# EAGLE design LPEM (EAGLE 9.3.1)

## Sheet 1 of 2
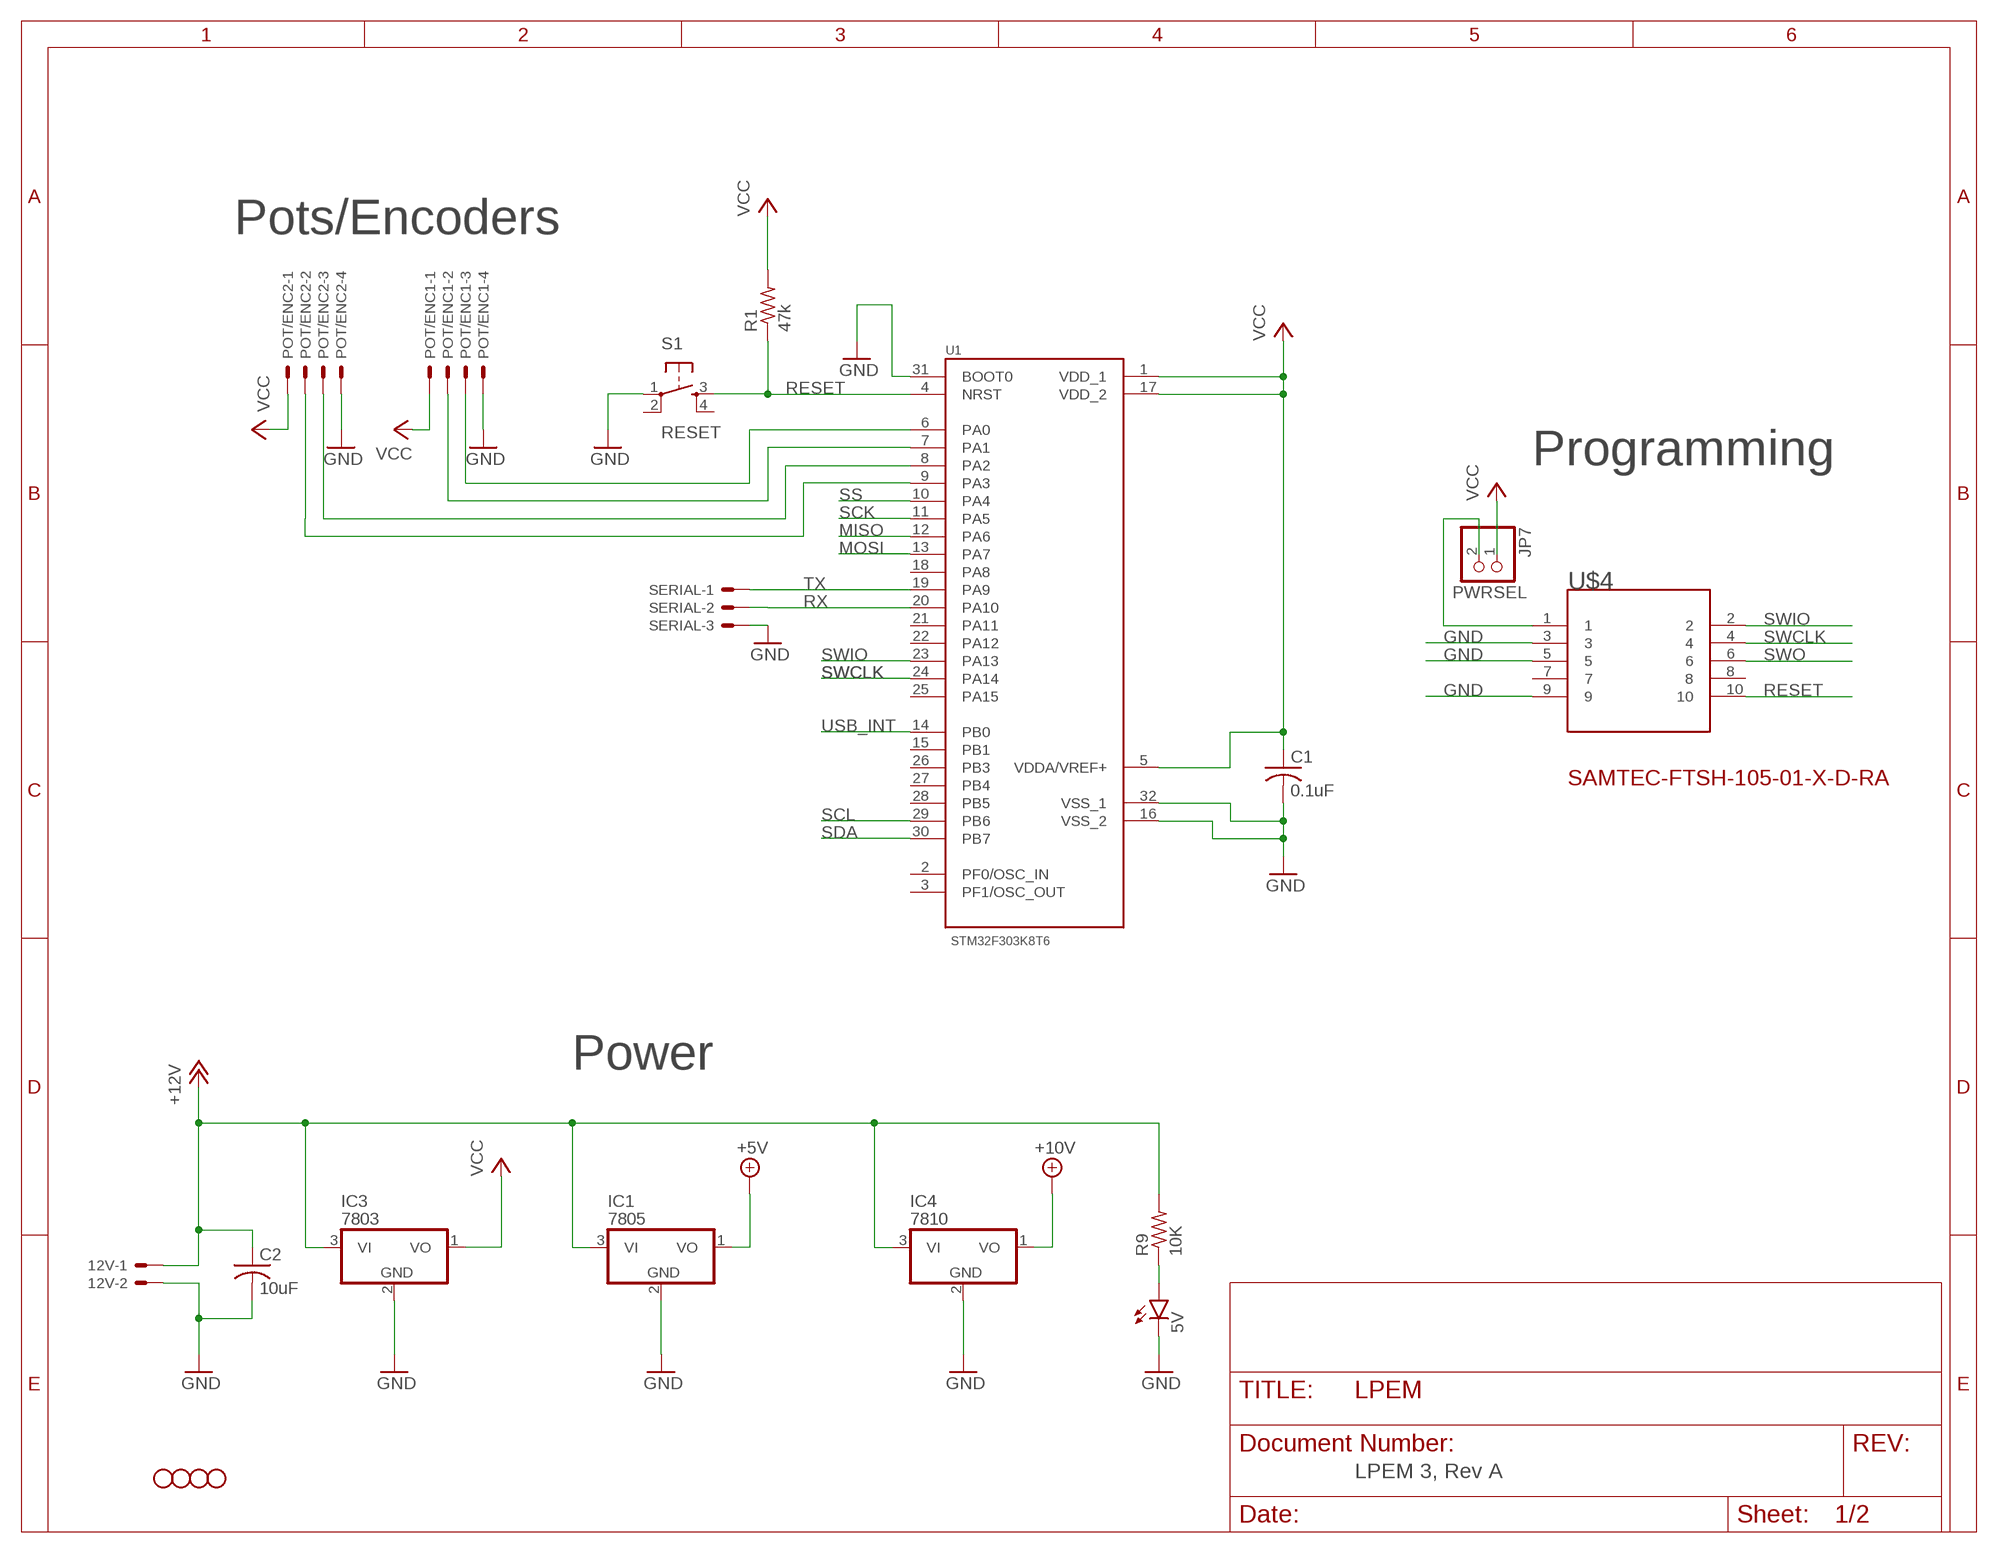
[diagram p0: schematic, sheet 1]

### Parts
5V  LED3MM  [LED3MM]
12V  22-23-2021  [22-23-2021]
C1  0.1uF  C-US025-025X050  [C025-025X050]
C2  10uF  C-US025-025X050  [C025-025X050]
IC1  7805  78L05Z  [TO92]
IC3  7803  78L05Z  [TO92]
IC4  7810  78L05Z  [TO92]
JP1  STAND-OFF  [STAND-OFF]
JP2  STAND-OFF  [STAND-OFF]
JP7  PWRSEL  PINHD-1X2  [1X02]
JP8  STAND-OFF  [STAND-OFF]
JP9  STAND-OFF  [STAND-OFF]
POT/ENC1  22-23-2041  [22-23-2041]
POT/ENC2  22-23-2041  [22-23-2041]
R1  47k  R-US_0204/5  [0204/5]
R9  10K  R-US_0204/5  [0204/5]
S1  RESET  TAC_SWITCHPTH  [TACTILE-PTH]
SERIAL  22-23-2031  [22-23-2031]
U1  STM32F303K8T6  [QFP80P900X900X160-32N]
U$4  SAMTEC-FTSH-105-01-X-D-RAJ  [SAMTEC-FTSH-105-01-X-D-RA]

### Nets
+5V [power]: IC1.1(VO) ; also sheet 2
+10V [power]: IC4.1(VO) ; also sheet 2
+12V [power]: 12V.1 C2.1 IC1.3(VI) IC3.3(VI) IC4.3(VI) R9.2 ; also sheet 2
GND [power]: 5V.K(C) 12V.2 C1.2 C2.2 IC1.2(GND) IC3.2(GND) IC4.2(GND) POT/ENC1.4 POT/ENC2.4 S1.1 SERIAL.3 U1.16(VSS_2) U1.31(BOOT0) U1.32(VSS_1) U$4.3 U$4.5 U$4.9 ; also sheet 2
MISO: U1.12(PA6) ; also sheet 2
MOSI: U1.13(PA7) ; also sheet 2
N$1: POT/ENC2.3 U1.8(PA2)
N$2: POT/ENC2.2 U1.9(PA3)
N$3: POT/ENC1.3 U1.6(PA0)
N$4: JP7.2 U$4.1
N$5: 5V.A R9.1
N$6: POT/ENC1.2 U1.7(PA1)
RESET: R1.1 S1.3 U1.4(NRST) U$4.10
RX: SERIAL.2 U1.20(PA10)
SCK: U1.11(PA5) ; also sheet 2
SCL: U1.29(PB6) ; also sheet 2
SDA: U1.30(PB7) ; also sheet 2
SS: U1.10(PA4) ; also sheet 2
SWCLK: U1.24(PA14) U$4.4
SWIO: U1.23(PA13) U$4.2
SWO: U$4.6
TX: SERIAL.1 U1.19(PA9)
USB_INT: U1.14(PB0) ; also sheet 2
VCC [power]: C1.1 IC3.1(VO) JP7.1 POT/ENC1.1 POT/ENC2.1 R1.2 U1.1(VDD_1) U1.5(VDDA/VREF+) U1.17(VDD_2) ; also sheet 2
Unconnected: S1.2 S1.4 U1.2(PF0/OSC_IN) U1.3(PF1/OSC_OUT) U1.15(PB1) U1.18(PA8) U1.21(PA11) U1.22(PA12) U1.25(PA15) U1.26(PB3) U1.27(PB4) U1.28(PB5) U$4.7 U$4.8

### Notes on the sheet
- Pots/Encoders
- Programming
- Power
- LPEM 3, Rev A

## Sheet 2 of 2
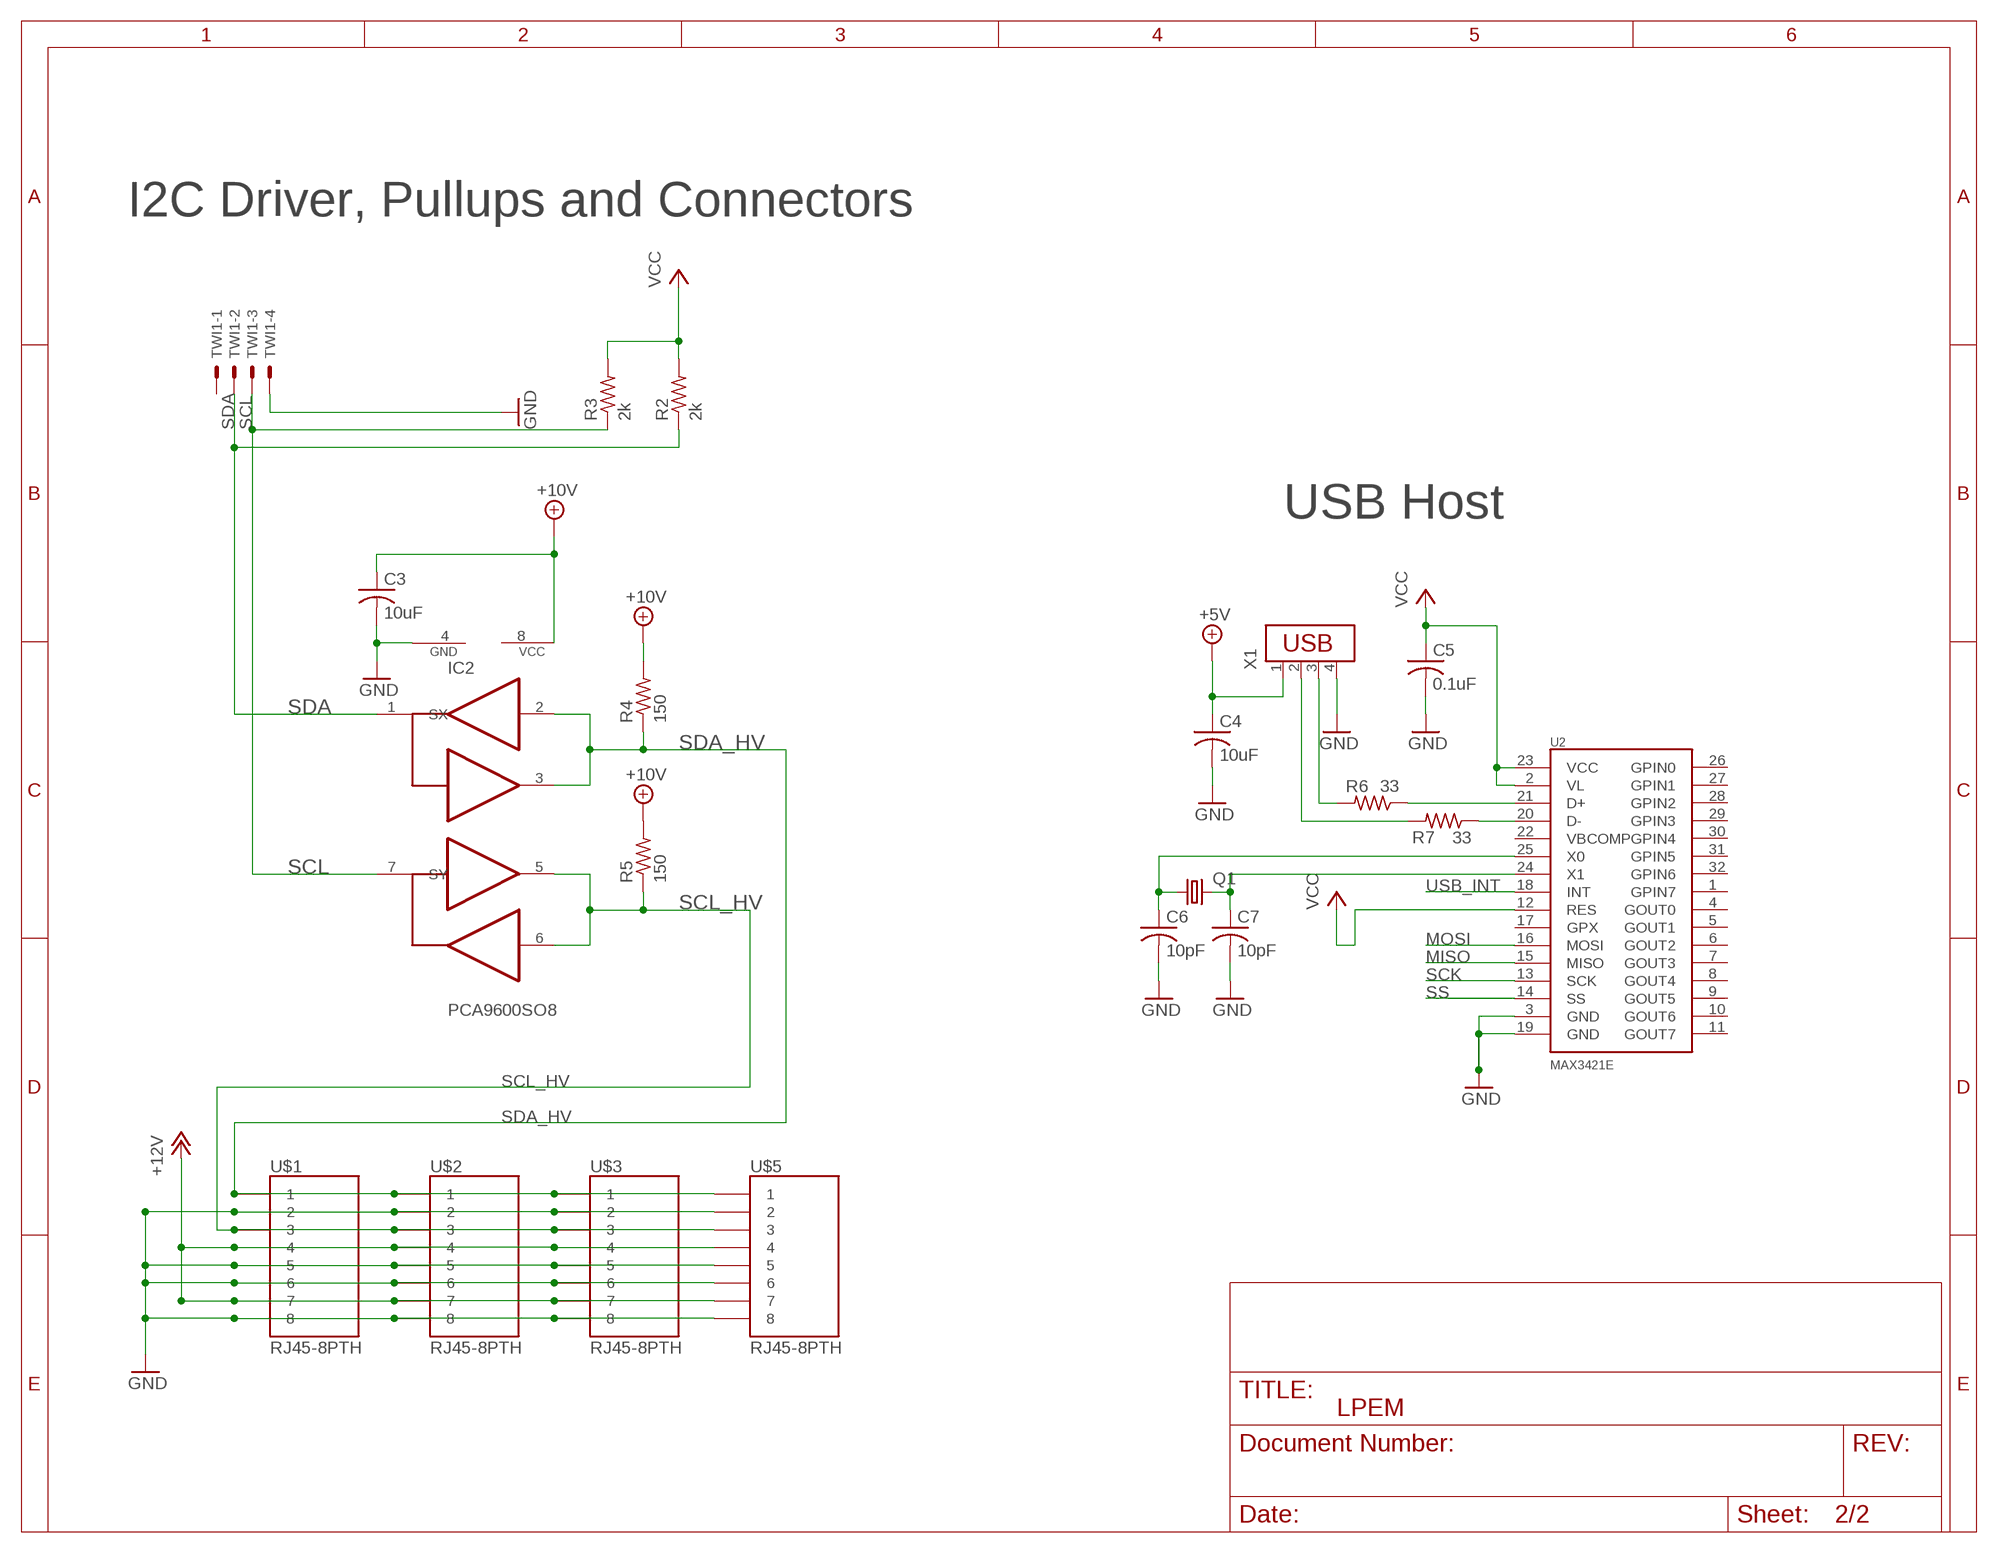
[diagram p1: schematic, sheet 2]

### Parts
C3  10uF  C-US025-025X050  [C025-025X050]
C4  10uF  C-US025-025X050  [C025-025X050]
C5  0.1uF  C-US025-025X050  [C025-025X050]
C6  10pF  C-US025-025X050  [C025-025X050]
C7  10pF  C-US025-025X050  [C025-025X050]
IC2  PCA9600SO8  [SO08]
Q1  CRYSTALHC18U-V  [HC18U-V]
R2  2k  R-US_0204/5  [0204/5]
R3  2k  R-US_0204/5  [0204/5]
R4  150  R-US_0204/5  [0204/5]
R5  150  R-US_0204/5  [0204/5]
R6  33  R-US_0204/5  [0204/5]
R7  33  R-US_0204/5  [0204/5]
TWI1  22-23-2041  [22-23-2041]
U2  MAX3421E  [TQFP32-5MM]
U$1  RJ45-8PTH  [RJ45-8]
U$2  RJ45-8PTH  [RJ45-8]
U$3  RJ45-8PTH  [RJ45-8]
U$5  RJ45-8PTH  [RJ45-8]
X1  USB-787616  [USB]

### Nets
+5V [power]: C4.1 X1.1 ; also sheet 1
+10V [power]: C3.1 IC2.8(VCC) R4.2 R5.2 ; also sheet 1
+12V [power]: U$1.4 U$1.7 U$2.4 U$2.7 U$3.4 U$3.7 U$5.4 U$5.7 ; also sheet 1
GND [power]: C3.2 C4.2 C5.2 C6.2 C7.2 IC2.4(GND) TWI1.4 U2.3(GND) U2.19(GND) U$1.2 U$1.5 U$1.6 U$1.8 U$2.2 U$2.5 U$2.6 U$2.8 U$3.2 U$3.5 U$3.6 U$3.8 U$5.2 U$5.5 U$5.6 U$5.8 X1.4 ; also sheet 1
MISO: U2.15(MISO) ; also sheet 1
MOSI: U2.16(MOSI) ; also sheet 1
N$7: R6.2 X1.3
N$8: R7.2 X1.2
N$9: C6.1 Q1.1 U2.25(X0)
N$10: C7.1 Q1.2 U2.24(X1)
N$11: R6.1 U2.21(D+)
N$12: R7.1 U2.20(D-)
SCK: U2.13(SCK) ; also sheet 1
SCL: IC2.7(SY) R3.1 TWI1.3 ; also sheet 1
SCL_HV: IC2.5(TY) IC2.6(RY) R5.1 U$1.3 U$2.3 U$3.3 U$5.3
SDA: IC2.1(SX) R2.1 TWI1.2 ; also sheet 1
SDA_HV: IC2.2(RX) IC2.3(TX) R4.1 U$1.1 U$2.1 U$3.1 U$5.1
SS: U2.14(SS) ; also sheet 1
USB_INT: U2.18(INT) ; also sheet 1
VCC [power]: C5.1 R2.2 R3.2 U2.2(VL) U2.12(RES) U2.23(VCC) ; also sheet 1
Unconnected: TWI1.1 U2.1(GPIN7) U2.4(GOUT0) U2.5(GOUT1) U2.6(GOUT2) U2.7(GOUT3) U2.8(GOUT4) U2.9(GOUT5) U2.10(GOUT6) U2.11(GOUT7) U2.17(GPX) U2.22(VBCOMP) U2.26(GPIN0) U2.27(GPIN1) U2.28(GPIN2) U2.29(GPIN3) U2.30(GPIN4) U2.31(GPIN5) U2.32(GPIN6)

### Notes on the sheet
- I2C Driver, Pullups and Connectors
- USB Host

## Library data of the parts
5V = led:LED: LED OSRAM: - CHIPLED LG R971, LG N971, LY N971, LG Q971, LY Q971, LO R971, LY R971 LH N974, LH R974 LS Q976, LO Q976, LY Q976 LO Q996 - Hyper CHIPLED LW Q18S LB Q993, LB Q99A, LB R99A - SideLED LS A670, LO A670, LY A670, LG A670, LP A670 LB A673, LV A673, LT A673, LW A673 LH A674 LY A675 LS A676, LA A676, LO A676, LY A676, LW A676 LS A679, LY A679, LG A679 - Hyper Micro SIDELED® LS Y876, LA Y876, LO Y876, LY Y876 LT Y87S - SmartLED LW L88C, LW L88S LB L89C, LB L89S, LG L890 LS L89K, LO L89K, LY L89K LS L896, LA L896, LO L896, LY L896 - TOPLED LS T670, LO T670, LY T670, LG T670, LP T670 LSG T670, LSP T670, LSY T670, LOP T670, LYG T670 LG T671, LOG T671, LSG T671 LB T673, LV T673, LT T673, LW T673 LH T674 LS T676, LA T676, LO T676, LY T676, LB T676, LH T676, LSB T676, LW T676 LB T67C, LV T67C, LT T67C, LS T67K, LO T67K, LY T67K, LW E67C LS E67B, LA E67B, LO E67B, LY E67B, LB E67C, LV E67C, LT E67C LW T67C LS T679, LY T679, LG T679 LS T770, LO T770, LY T770, LG T770, LP T770 LB T773, LV T773, LT T773, LW T773 LH T774 LS E675, LA E675, LY E675, LS T675 LS T776, LA T776, LO T776, LY T776, LB T776 LHGB T686 LT T68C, LB T68C - Hyper Mini TOPLED® LB M676 - Mini TOPLED Santana® LG M470 LS M47K, LO M47K, LY M47K Source: http://www.osram.convergy.de LUXEON: - LUMILED® LXK2-PW12-R00, LXK2-PW12-S00, LXK2-PW14-U00, LXK2-PW14-V00 LXK2-PM12-R00, LXK2-PM12-S00, LXK2-PM14-U00 LXK2-PE12-Q00, LXK2-PE12-R00, LXK2-PE12-S00, LXK2-PE14-T00, LXK2-PE14-U00 LXK2-PB12-K00, LXK2-PB12-L00, LXK2-PB12-M00, LXK2-PB14-N00, LXK2-PB14-P00, LXK2-PB14-Q00 LXK2-PR12-L00, LXK2-PR12-M00, LXK2-PR14-Q00, LXK2-PR14-R00 LXK2-PD12-Q00, LXK2-PD12-R00, LXK2-PD12-S00 LXK2-PH12-R00, LXK2-PH12-S00 LXK2-PL12-P00, LXK2-PL12-Q00, LXK2-PL12-R00 Source: www.luxeon.com KINGBRIGHT: KA-3528ASYC Source: www.kingbright.com
12V = con-molex:22-23-2021: .100" (2.54mm) Center Header - 2 Pin; MF: MOLEX; MPN: 22-23-2021; OC_FARNELL: 1462926; OC_NEWARK: 25C3832
C1-C7 = rcl:C-US: CAPACITOR, American symbol; SPICEPREFIX: C
IC1 IC3 IC4 = linear:78*: Positive VOLTAGE REGULATOR Source: http://cache.national.com/ds/LM/LM78L05.pdf http://www.fairchildsemi.com/ds/LM/LM7805.pdf
IC2 = 4534_I2C2:PCA9600: I2C ACTIVE TERMINATOR SO-8
JP1 JP2 JP8 JP9 = SparkFun:STAND-OFF: Stand Off This is the mechanical footprint for a #4 phillips button head screw. Use the keepout ring to avoid running the screw head into surrounding components. SKU : PRT-00447
JP7 = pinhead:PINHD-1X2: PIN HEADER
POT/ENC1 POT/ENC2 TWI1 = con-molex:22-23-2041: .100" (2.54mm) Center Header - 4 Pin; MF: MOLEX; MPN: 22-23-2041; OC_FARNELL: 1462920; OC_NEWARK: 38C0355
Q1 = crystal:CRYSTAL: CRYSTAL; OC_FARNELL: unknown; OC_NEWARK: unknown
R1-R7 R9 = rcl:R-US_: RESISTOR, American symbol; SPICEPREFIX: R
S1 = SparkFun:TAC_SWITCH: Momentary Switch Button commonly used for reset or general input. Spark Fun Electronics SKU : COM-00097
SERIAL = con-molex:22-23-2031: .100" (2.54mm) Center Header - 3 Pin; MF: MOLEX; MPN: 22-23-2031; OC_FARNELL: 1462950; OC_NEWARK: 30C0862
U1 = STM32F303K8T6:STM32F303K8T6: Analog and DSP with FPU ARM Cortex-M4 MCU with 64 Kbytes Flash, 72 MHz CPU, CCM, 12-bit ADC 5 MSPS, comparators, op-amp; AVAILABILITY: Unavailable; DESCRIPTION: Analog and DSP with FPU ARM Cortex-M4 MCU with 64 Kbytes Flash, 72 MHz CPU, CCM, 12-bit ADC 5 MSPS, comparators, op-amp; MF: STMicroelectronics; MP: STM32F303K8T6; PACKAGE: LQFP-32 STMicroelectronics; PRICE: None
U2 = MAX3421E:MAX3421E: USB Peripheral/Host Controller with SPI Interface.; AVAILABILITY: Unavailable; DESCRIPTION: 1.2v To +5.5v, ±15kv Esd-Protected, 0.1µa, 35mbps, 8-Channel Level Translators; MF: Maxim Integrated; MP: MAX3421E; PACKAGE: None; PRICE: None
U$1-U$3 U$5 = SparkFun:RJ45-8: RJ45 Jack Simple RJ45, 8-pin connection - connector for common Cat5, Cat5e, and Cat6 Ethernet cables. Footprint not yet proven in production. Connector sku is PRT-00643; Breakout PCB sku is BOB-00716.
U$4 = SAMTEC-FTSH-105-01-X-D-RA:SAMTEC-FTSH-105-01-X-D-RA; AVAILABILITY: Unavailable; DESCRIPTION: Conn Unshrouded Header HDR 10 POS 1.27mm Solder RA Thru-Hole Tube; MF: Samtec Inc.; MP: FTSH-105-01-L-D-RA-K; PACKAGE: None; PRICE: None
X1 = con-amp:USB-787616: AMP connector

## Net classes
0 default: width 0.152 mm, drill 0.152 mm, clearance 0.152 mm
1 power: width 0.305 mm, drill 0.305 mm, clearance 0.152 mm to class 0, clearance 0.152 mm

## Board
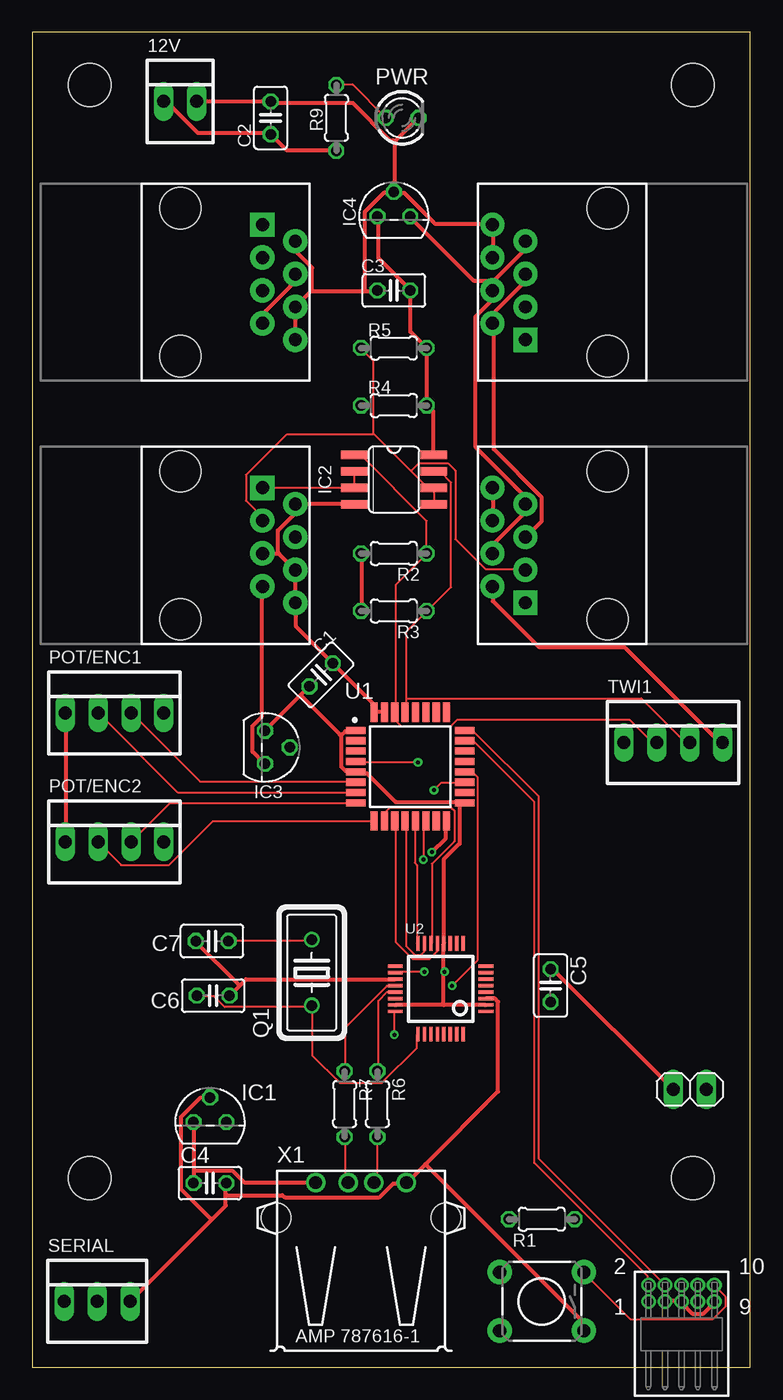
[diagram p2: board, top side]
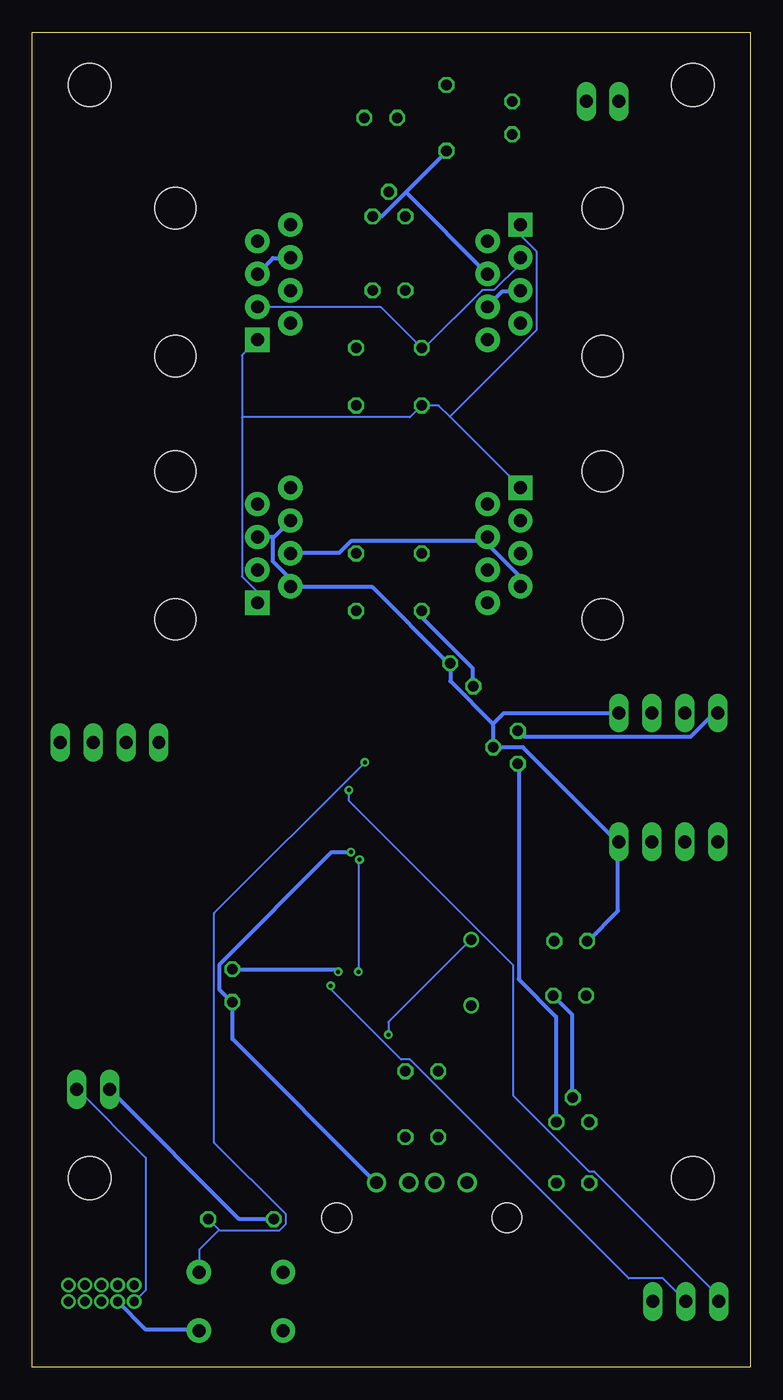
[diagram p3: board, bottom side, seen from below]

Size 55.5 x 103.12 mm. Coordinates in mm from the lower left corner, seen from the top.
Outline: 0,0 55.5,0 55.5,103.12 0,103.12 0,0
Copper layers (1*16): Top 0.0356mm / dielectric 1.5011mm / Bottom 0.0356mm
Design rules "DorkbotPDX *": minimum track width 6mil, minimum drill 12mil, track to track 7mil, track to pad 7mil, pad to pad 7mil, via to via 7mil, smd to smd 6mil, copper to edge 15mil, drill to drill 15mil, minimum pad ring 7mil, minimum via ring 7mil, stop-mask expansion 4mil, vias tented up to drill 13mil, thermal gap 10mil
tRestrict: area -1.3,100.6 to 6.3,104.4; area -1,96.8 to 2.3,100.6; area 1.5,11.3 to 7.5,17.6; area 48.1,11.4 to 54.1,17.7

### Footprints (pad centres in the part's own frame; a part is rotated, then mirrored left to right if it is on the bottom)
LED3MM = drill 0.813 octagon: A -1.27,0; K 1.27,0
22-23-2021 = drill 1 long: 1 -1.27,0; 2 1.27,0
C025-025X050 = drill 0.813 octagon: 1 -1.27,0; 2 1.27,0
TO92 = drill 0.813 octagon: 1 -1.27,0; 2 0,1.905; 3 1.27,0
SO08 = smd 0.66 x 2.032: 1 -1.905,-3.073; 2 -0.635,-3.073; 3 0.635,-3.073; 4 1.905,-3.073; 5 1.905,3.073; 6 0.635,3.073; 7 -0.635,3.073; 8 -1.905,3.073
STAND-OFF = hole 3.302: 0,0
1X02 = drill 1.016 long: 1 -1.27,0; 2 1.27,0
22-23-2041 = drill 1 long: 1 -3.81,0; 2 -1.27,0; 3 1.27,0; 4 3.81,0
HC18U-V = drill 0.813: 1 -2.54,0; 2 2.54,0
0204/5 = drill 0.813 octagon: 1 -2.54,0; 2 2.54,0
TACTILE-PTH = drill 1.016 pad 1.88: 1 -3.251,2.261; 2 3.251,2.261; 3 -3.251,-2.261; 4 3.251,-2.261
22-23-2031 = drill 1 long: 1 -2.54,0; 2 0,0; 3 2.54,0
QFP80P900X900X160-32N = smd 1.5 x 0.55: 1 -4.2,2.8; 2 -4.2,2; 3 -4.2,1.2; 4 -4.2,0.4; 5 -4.2,-0.4; 6 -4.2,-1.2; 7 -4.2,-2; 8 -4.2,-2.8; 17 4.2,-2.8; 18 4.2,-2; 19 4.2,-1.2; 20 4.2,-0.4; 21 4.2,0.4; 22 4.2,1.2; 23 4.2,2; 24 4.2,2.8 | smd 0.55 x 1.5: 9 -2.8,-4.2; 10 -2,-4.2; 11 -1.2,-4.2; 12 -0.4,-4.2; 13 0.4,-4.2; 14 1.2,-4.2; 15 2,-4.2; 16 2.8,-4.2; 25 2.8,4.2; 26 2,4.2; 27 1.2,4.2; 28 0.4,4.2; 29 -0.4,4.2; 30 -1.2,4.2; 31 -2,4.2; 32 -2.8,4.2
TQFP32-5MM = smd 1.143 x 0.254: 1 -3.5,1.75; 2 -3.5,1.25; 3 -3.5,0.75; 4 -3.5,0.25; 5 -3.5,-0.25; 6 -3.5,-0.75; 7 -3.5,-1.25; 8 -3.5,-1.75; 17 3.5,-1.75; 18 3.5,-1.25; 19 3.5,-0.75; 20 3.5,-0.25; 21 3.5,0.25; 22 3.5,0.75; 23 3.5,1.25; 24 3.5,1.75 | smd 0.254 x 1.143: 9 -1.75,-3.5; 10 -1.25,-3.5; 11 -0.75,-3.5; 12 -0.25,-3.5; 13 0.25,-3.5; 14 0.75,-3.5; 15 1.25,-3.5; 16 1.75,-3.5; 25 1.75,3.5; 26 1.25,3.5; 27 0.75,3.5; 28 0.25,3.5; 29 -0.25,3.5; 30 -0.75,3.5; 31 -1.25,3.5; 32 -1.75,3.5
RJ45-8 = drill 1 pad 1.88 square: 1 -4.445,6.35 | drill 1 pad 1.88: 2 -3.175,8.89; 3 -1.905,6.35; 4 -0.635,8.89; 5 0.635,6.35; 6 1.905,8.89; 7 3.175,6.35; 8 4.445,8.89 | hole 3.2: -5.715,0; 5.715,0
SAMTEC-FTSH-105-01-X-D-RA = drill 0.71 pad 1.143: 1 -2.54,2.527; 2 -2.54,3.797; 3 -1.27,2.527; 4 -1.27,3.797; 5 0,2.527; 6 0,3.797; 7 1.27,2.527; 8 1.27,3.797; 9 2.54,2.527; 10 2.54,3.797
USB = drill 1: 1 -3.5,12.99; 2 -1,12.99; 3 1,12.99; 4 3.5,12.99 | hole 2.3: -6.57,10.28; 6.57,10.28

### Placement (x,y rotation side)
5V  28.57,96.52 0 top
12V  11.43,97.79 0 top
C1  22.32,53.49 45 top
C2  18.41,96.52 90 top
C3  27.94,83.19 180 top
C4  13.73,14.22 0 top
C5  40.05,29.48 270 top
C6  13.97,28.7 0 top
C7  13.89,32.92 180 top
IC1  13.73,18.93 0 top
IC2  27.94,68.58 270 top
IC3  17.98,47.88 270 top
IC4  27.94,88.9 0 top
JP1  4.45,99.06 0 top
JP2  51.05,99.06 0 top
JP7  50.8,21.46 0 top
JP8  4.45,14.61 0 top
JP9  51.05,14.61 0 top
POT/ENC1  6.35,50.54 0 top
POT/ENC2  6.35,40.59 0 top
Q1  21.59,30.48 90 top
R1  39.37,11.43 180 top
R2  27.94,62.87 180 top
R3  27.94,58.42 180 top
R4  27.94,74.3 0 top
R5  27.94,78.74 0 top
R6  26.67,20.32 270 top
R7  24.13,20.32 270 top
R9  23.5,96.52 270 top
S1  39.37,5.08 180 top
SERIAL  5,5.08 0 top
TWI1  49.53,48.26 0 top
U1  29.21,46.4 0 top
U2  31.55,29.23 180 top
U$1  44.45,63.5 90 top
U$2  44.45,83.82 90 top
U$3  11.43,83.82 270 top
U$4  50.16,2.54 0 top
U$5  11.43,63.5 270 top
X1  25.4,1.27 0 top

### Tracks (layer width: path | path; a pad name or v marks a point on that pad's centre or on a via)
+5V
  Top 0.305: 12.46,15.19 12.46,18.9 IC1.1 | 12.46,15.19 12.46,14.28 C4.1 | X1.1 21.88,14.28 16.34,14.28 15.44,15.19 12.55,15.19 12.46,15.19
+10V
  Top 0.305: IC2.8 30.96,70.5 30.96,73.88 30.54,74.3 R4.2 30.46,74.38 30.46,78.59 R5.2 30.46,78.75 29.22,79.99 29.22,83.13 C3.1 29.14,83.29 26.75,85.69 26.75,88.82 IC4.1
+12V
  Top 0.305: U$2.4 35.58,83.21 35.58,83.87 38.06,86.35 38.06,86.92 U$2.7 | U$3.7 17.83,80.65 17.83,81.39 20.31,83.87 20.31,84.45 U$3.4 | R9.2 23.44,94.02 19.65,94.02 18.49,95.18 C2.1 18.33,95.34 12.79,95.34 10.4,97.74 10.24,97.74 12V.1 | U$2.4 35.5,83.95 34.09,83.95 29.22,88.82 IC4.3 | U$1.4 35.58,62.9 35.58,63.56 38.06,66.04 38.06,66.62 U$1.7 38.06,66.78 38.06,67.28 34.26,71.08 34.26,81.15 35.5,82.39 35.5,83.05 U$2.4 | U$5.7 17.75,60.26 17.75,50.27 17,49.53 17,47.55 17.91,46.64 IC3.3
  Bottom 0.305: 26.62,90.76 23.44,93.94 R9.2 | 26.62,90.76 28.48,88.91 29.14,88.91 IC4.3 | U$3.4 20.39,84.53 26.58,90.72 26.62,90.76 | U$5.7 17.83,60.34 17.83,61.09 20.31,63.56 20.31,64.06 U$5.4 20.39,63.81 30.87,63.81 31.78,62.9 35.5,62.9 U$1.4 | IC1.3 15.02,18.99 15.02,27.08 17.91,29.97 17.91,46.56 IC3.3
GND  (via drill 0.3)
  Top 0.305: v30.87,39.79 31.95,40.86 31.95,42.18 U1.16 | U$4.3 48.95,5.12 50.11,5.12 U$4.5 50.19,4.95 51.02,4.13 51.84,4.13 52.34,4.62 52.34,4.71 52.67,5.04 U$4.9 | 30.38,15.68 28.98,14.28 X1.4 28.81,14.2 27.9,14.2 26.83,13.12 19.48,13.12 19.32,13.29 15.02,13.29 14.94,13.29 | 30.38,15.68 35.99,21.3 35.99,28.23 35.74,28.48 35.08,28.48 U2.3 | S1.1 42.6,2.89 42.6,3.47 30.46,15.6 30.38,15.68 | 21.63,83.13 21.55,83.13 20.39,81.97 U$3.6 20.31,81.81 20.31,79.41 U$3.8 | 21.63,83.13 25.67,83.13 | 25.67,83.13 26.66,83.13 C3.2 | U$3.2 20.39,86.92 20.39,86.18 21.63,84.94 21.63,83.21 21.63,83.13 | U$2.6 35.58,85.77 35.58,88.25 U$2.8 35.41,88.33 31.12,88.33 28.73,90.72 28.07,90.72 IC4.2 | U$2.5 38.06,84.45 38.06,83.87 35.58,81.39 35.58,80.65 U$2.2 35.66,80.57 35.66,70.91 39.38,67.2 39.38,65.38 38.14,64.14 U$1.5 | 12V.2 12.71,97.82 18.41,97.82 C2.2 18.49,97.66 24.77,97.66 27.65,94.77 27.9,94.77 27.98,94.69 | 27.98,94.69 27.98,90.81 IC4.2 | 27.98,94.69 29.8,96.5 5V.K | 25.67,83.13 25.67,83.21 25.67,89.24 27.16,90.72 27.82,90.72 IC4.2 | U$1.6 35.58,65.46 35.58,67.94 U$1.8 | TWI1.4 53.33,48.29 53.08,48.29 45.73,55.64 39.13,55.64 35.58,59.19 35.58,60.26 U$1.2 | IC2.4 24.85,66.7 20.39,66.7 U$5.2 20.31,66.53 20.31,65.96 18.99,64.64 18.99,62.9 18.99,62.82 | 18.99,62.82 19.07,62.82 20.23,61.66 U$5.6 20.31,61.58 20.31,59.11 U$5.8 20.39,58.94 20.39,57.21 23.11,54.48 C1.2 23.28,54.32 26.33,51.26 26.33,50.69 U1.32 27.16,50.6 U1.31 | 18.99,62.82 17.83,62.82 U$5.5 | 14.94,13.29 14.94,12.46 13.87,11.39 | 14.94,13.29 14.94,14.2 C4.2 | 13.87,11.39 7.59,5.12 SERIAL.3 | 16.02,29.47 15.27,28.73 C6.2
  Top 0.305: 16.02,29.47 16.51,29.97 27.98,29.97 U2.19 | C7.2 12.63,32.85 15.93,29.55 16.02,29.47 | 13.87,11.39 13.79,11.47 11.47,13.79 11.47,19.32 12.96,20.8 13.7,20.8 IC1.2
  Bottom 0.305: v30.87,39.79 32.36,39.79 41.03,31.12 41.03,29.14 40.12,28.23 C5.2 40.04,28.07 40.04,25.34 28.98,14.28 X1.4 | U$4.3 48.87,5.04 46.72,2.89 42.68,2.89 S1.1 | U$3.5 17.83,83.13 19.15,83.13 20.31,81.97 U$3.6 | U$2.6 35.58,85.69 36.9,85.69 38.06,84.53 U$2.5 | 36.9,64.14 36.82,64.14 35.58,65.38 U$1.6 | 36.9,64.14 38.06,64.14 U$1.5 | 36.9,64.14 36.9,64.06 36.9,62.24 35.58,60.92 35.58,60.34 U$1.2 35.41,60.26 29.22,60.26 23.36,54.4 C1.2 23.2,54.32 23.2,53 19.89,49.7 | 19.89,49.7 19.89,47.96 IC3.2 19.73,47.88 17.58,47.88 10.32,40.62 POT/ENC2.4 10.24,40.53 10.24,35.25 12.55,32.94 C7.2 | POT/ENC1.4 10.24,50.52 19.07,50.52 19.81,49.78 19.89,49.7 | IC1.2 13.79,20.89 13.79,27.24 15.19,28.64 C6.2
MISO
  Top 0.152: U2.15 30.3,32.69 30.3,32.11 30.05,31.86 29.55,31.86 28.89,32.52 28.89,42.18 U1.12
MOSI
  Top 0.152: U2.16 29.72,32.77 29.72,38.8 29.55,38.96 29.55,42.18 U1.13
N$1
  Top 0.152: U1.8 24.93,43.59 10.65,43.59 7.68,40.62 POT/ENC2.3
N$2
  Top 0.152: U1.9 26.33,42.18 13.95,42.18 10.57,38.8 6.85,38.8 5.12,40.53 POT/ENC2.2
N$3
  Top 0.152: U1.6 24.93,45.24 12.96,45.24 7.68,50.52 POT/ENC1.3
N$4
  Bottom 0.152: U$4.1 47.55,5.12 46.72,5.94 46.72,16.18 52.01,21.46 JP7.2
N$5
  Top 0.152: R9.1 23.53,99.06 24.77,99.06 27.24,96.58 5V.A
N$6
  Top 0.152: U1.7 24.93,44.41 11.23,44.41 5.12,50.52 POT/ENC1.2
N$7
  Top 0.152: R6.2 26.66,17.75 26.66,14.53 26.42,14.28 X1.3
N$8
  Top 0.152: R7.2 24.19,17.75 24.19,14.45 24.35,14.28 X1.2
N$9
  Top 0.152: 21.63,27.82 21.63,27.9 Q1.1 21.63,27.82 | 21.63,27.82 21.63,24.11 23.77,21.96 26.99,21.96 29.72,24.68 29.72,25.67 U2.25 | 21.63,27.82 14.86,27.82 14.03,28.64 12.71,28.64 C6.1
N$10  (via drill 0.3)
  Top 0.152: v27.98,25.67 27.98,27.41 U2.24 | C7.1 15.19,32.94 21.46,32.94 21.55,33.02 Q1.2
  Bottom 0.152: v27.98,25.67 27.98,26.66 21.63,33.02 Q1.2
N$11
  Top 0.152: U2.21 27.98,28.98 27.41,28.98 26.75,28.32 26.75,22.87 R6.1
N$12
  Top 0.152: U2.20 27.98,29.47 27.41,29.47 24.19,26.25 24.19,22.87 R7.1
RESET  (via drill 0.3)
  Top 0.152: U$4.10 52.75,6.27 53.58,5.45 53.58,4.71 52.58,3.71 46.23,3.71 42.68,7.26 S1.3 | v29.8,46.72 25.01,46.72 U1.4
  Bottom 0.152: v29.8,46.72 41.44,35.08 41.44,17.34 35.91,11.8 35.91,11.06 36.41,10.57 41.03,10.57 41.07,10.61 | 41.07,10.61 41.85,11.39 R1.1 | S1.3 42.6,7.35 42.6,9.08 41.11,10.57 41.07,10.61
RX  (via drill 0.3)
  Top 0.152: v32.44,29.47 34.42,31.45 34.42,45.57 34.01,45.98 33.43,45.98 U1.20
  Bottom 0.152: v32.44,29.47 32.44,29.22 26.99,23.77 26.33,23.77 9.41,6.85 6.77,6.85 5.04,5.12 SERIAL.2
SCK
  Top 0.152: U2.13 31.29,32.69 31.29,32.11 30.71,31.53 29.39,31.53 28.07,32.85 28.07,42.18 U1.11
SCL
  Top 0.152: 28.89,51.68 28.89,56.79 30.46,58.36 R3.1 30.54,58.45 32.36,60.26 32.36,68.35 31.53,69.18 31.04,69.18 IC2.7 | 28.89,51.68 28.89,50.6 U1.29 | 28.89,51.68 47.05,51.68 50.44,48.29 50.77,48.29 TWI1.3
SCL_HV
  Top 0.152: IC2.5 31.04,66.7 31.04,67.94 IC2.6 30.96,68.02 30.46,68.02 29.26,69.22 | 26.38,72.11 26.33,72.15 26.33,77.76 25.43,78.67 R5.1 | 26.38,72.11 29.26,69.22 | U$5.3 17.75,65.46 17.75,65.71 16.51,66.95 16.51,68.93 19.65,72.07 26.33,72.07 26.38,72.11 | U$1.3 38.06,61.66 35,61.66 32.69,63.98 32.69,69.26 32.11,69.84 29.88,69.84 29.3,69.26 29.26,69.22
  Bottom 0.152: U$3.3 17.83,85.69 17.83,85.19 19.81,83.21 20.72,83.21 25.18,78.75 25.34,78.75 R5.1 25.43,78.75 28.56,81.89 38.06,81.89 U$2.3
SDA
  Top 0.152: IC2.1 24.93,70.42 25.43,70.42 30.46,65.38 30.46,62.9 R2.1 30.46,62.82 28.07,60.43 28.07,50.6 U1.30 28.07,50.52 28.07,49.94 28.48,49.53 32.36,49.53 32.85,50.02 46.15,50.02 47.88,48.29 48.21,48.29 TWI1.2
SDA_HV
  Top 0.152: IC2.2 24.85,69.18 24.85,68.02 IC2.3 24.85,67.94 17.83,67.94 U$5.1
  Bottom 0.152: 39.29,73.39 39.29,78.17 38.14,79.33 U$2.1 | 39.29,73.39 39.29,61.09 38.14,59.93 38.14,59.11 U$1.1 | 23.24,73.43 17.83,68.02 U$5.1 | 23.24,73.43 24.11,74.3 25.34,74.3 R4.1 25.43,74.3 26.33,73.39 39.29,73.39 | U$3.1 17.75,88.25 17.75,87.42 16.51,86.18 16.51,80.16 23.2,73.47 23.24,73.43
SS
  Top 0.152: U2.14 30.87,32.77 30.87,38.88 32.61,40.62 32.61,43.01 32.36,43.26 27.65,43.26 27.24,42.84 27.24,42.27 U1.10
SWCLK
  Top 0.152: U1.24 33.43,49.12 34.09,49.12 39.13,44.08 39.13,16.1 48.87,6.36 U$4.4
SWIO
  Top 0.152: U1.23 33.43,48.37 34.09,48.37 38.8,43.67 38.8,15.77 47.55,7.02 47.55,6.36 U$4.2
TX  (via drill 0.3)
  Top 0.152: v31.04,44.58 31.62,45.16 33.35,45.16 U1.19
  Bottom 0.152: v31.04,44.58 31.04,43.75 18.33,31.04 18.33,20.97 12.46,15.11 12.05,15.11 2.48,5.53 2.48,5.12 SERIAL.1
USB_INT  (via drill 0.3)
  Top 0.152: v30.3,30.54 28.07,30.54 U2.18 | v30.21,39.21 30.21,42.02 30.38,42.18 U1.14
  Bottom 0.152: v30.3,30.54 30.3,39.13 v30.21,39.21
VCC  (via drill 0.3)
  Top 0.305: JP7.1 40.28,30.71 40.12,30.71 C5.1 | 31.78,27.98 35,27.98 U2.2 | 31.78,27.98 28.07,27.98 U2.23 | 31.78,30.54 31.78,28.07 31.78,27.98 | 31.78,30.54 31.78,32.69 U2.12 31.78,32.85 31.78,39.21 33.02,40.45 33.02,43.59 U1.17 33.35,43.67 28.07,43.67 25.84,45.9 25.09,45.9 U1.5 24.93,46.06 24.19,46.06 23.86,46.39 23.86,48.79 | 23.86,48.79 24.19,49.12 24.93,49.12 U1.1 | POT/ENC2.1 2.56,40.62 2.56,50.52 POT/ENC1.1 | R3.2 25.43,58.45 25.43,62.82 R2.2 | 20.72,51.92 21.38,52.58 C1.1 | 20.72,51.92 18,49.2 IC3.1 | 23.86,48.79 23.77,48.87 20.8,51.84 20.72,51.92 | v31.86,30.54 31.78,30.54
  Bottom 0.305: JP7.1 39.54,11.47 36.9,11.47 R1.2 | R3.2 25.34,58.36 25.34,57.87 21.46,53.99 21.46,52.67 C1.1 | POT/ENC1.1 2.56,50.52 2.81,50.52 4.62,48.7 17.5,48.7 17.91,49.12 IC3.1 | v31.86,30.54 32.03,30.71 40.04,30.71 C5.1

### Text on the board
tNames: PWR
tDocu: 12V | GND | LPEM v3.0 / March '19 | TX | RX | GND | RESET